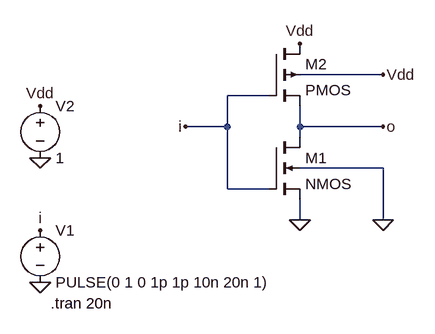
[diagram p0: schematic 1a-1.asc]
1a-1.asc, the LTspice schematic file:
Version 4
SHEET 1 880 680
WIRE 672 -128 544 -128
WIRE 496 -96 432 -96
WIRE 432 -48 432 -96
WIRE 432 -48 368 -48
WIRE 544 -48 544 -80
WIRE 672 -48 544 -48
WIRE 544 -32 544 -48
WIRE 672 16 544 16
WIRE 432 48 432 -48
WIRE 496 48 432 48
WIRE 544 96 544 64
WIRE 672 96 672 16
FLAG 144 192 0
FLAG 544 96 0
FLAG 672 -48 o
FLAG 672 -128 Vdd
FLAG 672 96 0
FLAG 368 -48 i
FLAG 144 0 0
FLAG 144 -80 Vdd
FLAG 144 112 i
FLAG 544 -176 Vdd
SYMBOL voltage 144 96 R0
WINDOW 123 0 0 Left 0
WINDOW 39 0 0 Left 0
SYMATTR InstName V1
SYMATTR Value PULSE(0 1 0 1p 1p 10n 20n 1)
SYMBOL pmos4 496 -176 R0
SYMATTR InstName M2
SYMBOL nmos4 496 -32 R0
SYMATTR InstName M1
SYMBOL voltage 144 -96 R0
WINDOW 123 0 0 Left 0
WINDOW 39 0 0 Left 0
SYMATTR InstName V2
SYMATTR Value 1
TEXT 160 224 Left 2 !.tran 20n

The netlist it stands for:
* 1a-1.asc
V1 i 0 PULSE(0 1 0 1p 1p 10n 20n 1)
M2 Vdd i o Vdd PMOS
M1 o i 0 0 NMOS
V2 Vdd 0 1
.model NMOS NMOS
.model PMOS PMOS
.lib standard.mos
.tran 20n
.backanno
.end